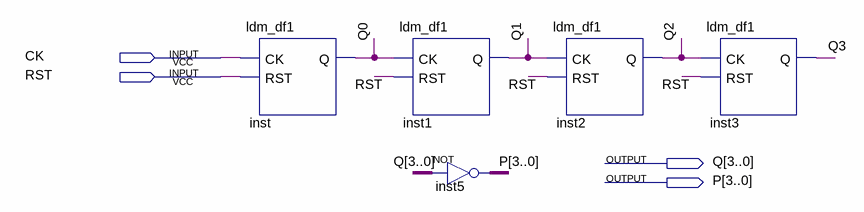
[diagram p0: schematic sheet]
// Quartus schematic ldm_df4.bdf as structural Verilog: 5 symbols, 4 pins
module ldm_df4 (
  input  CK,
  input  RST,
  output [3:0] Q,
  output [3:0] P
);

  ldm_df1 inst (.CK(CK), .RST(RST), .Q(Q[0]));
  ldm_df1 inst1 (.CK(Q[0]), .RST(RST), .Q(Q[1]));
  assign P = ~Q;  // NOT inst5, 4 bits wide
  ldm_df1 inst2 (.CK(Q[1]), .RST(RST), .Q(Q[2]));
  ldm_df1 inst3 (.CK(Q[2]), .RST(RST), .Q(Q[3]));
endmodule
